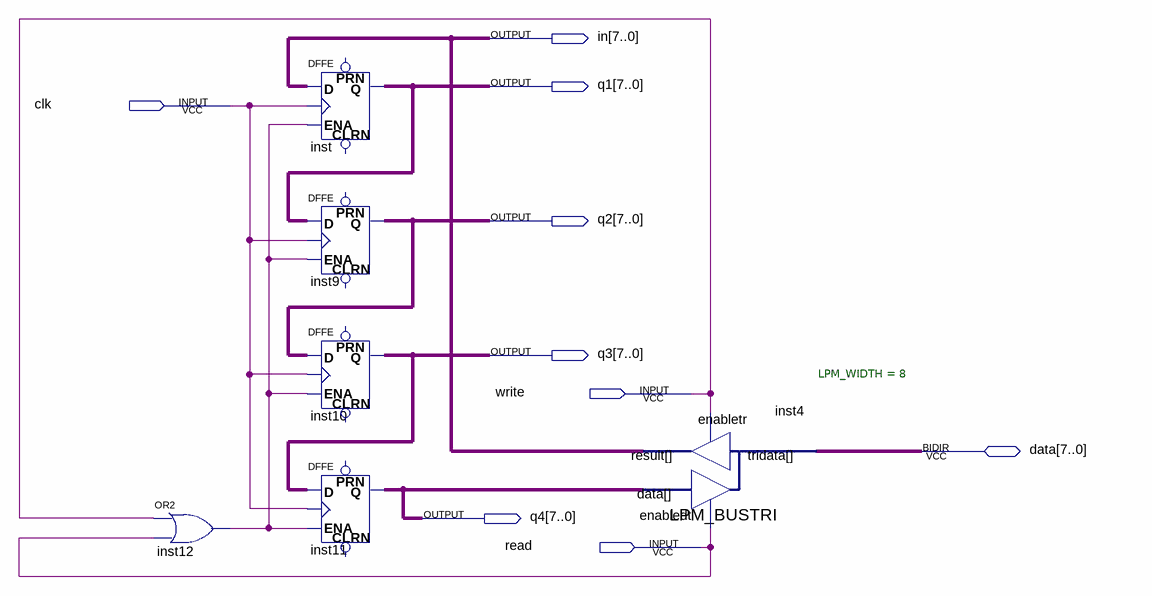
[diagram p0: schematic sheet]
// Quartus schematic buffer.bdf as structural Verilog: 6 symbols, 9 pins
module buffer (
  input  clk,
  input  write,
  input  read,
  inout  [7:0] data,
  output [7:0] in,
  output [7:0] q1,
  output [7:0] q2,
  output [7:0] q3,
  output [7:0] q4
);

  wire inst12_out;

  or inst12 (inst12_out, write, read);
  DFFE inst[7:0] (.D(in), .CLK(clk), .ENA(inst12_out), .Q(q1));  // open: PRN, CLRN
  DFFE inst9[7:0] (.D(q1), .CLK(clk), .ENA(inst12_out), .Q(q2));  // open: PRN, CLRN
  DFFE inst10[7:0] (.D(q2), .CLK(clk), .ENA(inst12_out), .Q(q3));  // open: PRN, CLRN
  DFFE inst11[7:0] (.D(q3), .CLK(clk), .ENA(inst12_out), .Q(q4));  // open: PRN, CLRN
  LPM_BUSTRI #(.LPM_WIDTH(8)) inst4 (.data(q4), .enabledt(read), .enabletr(write), .result(in), .tridata(data));
endmodule
